# EAGLE design Gamma-TOP (EAGLE 9.6.2)
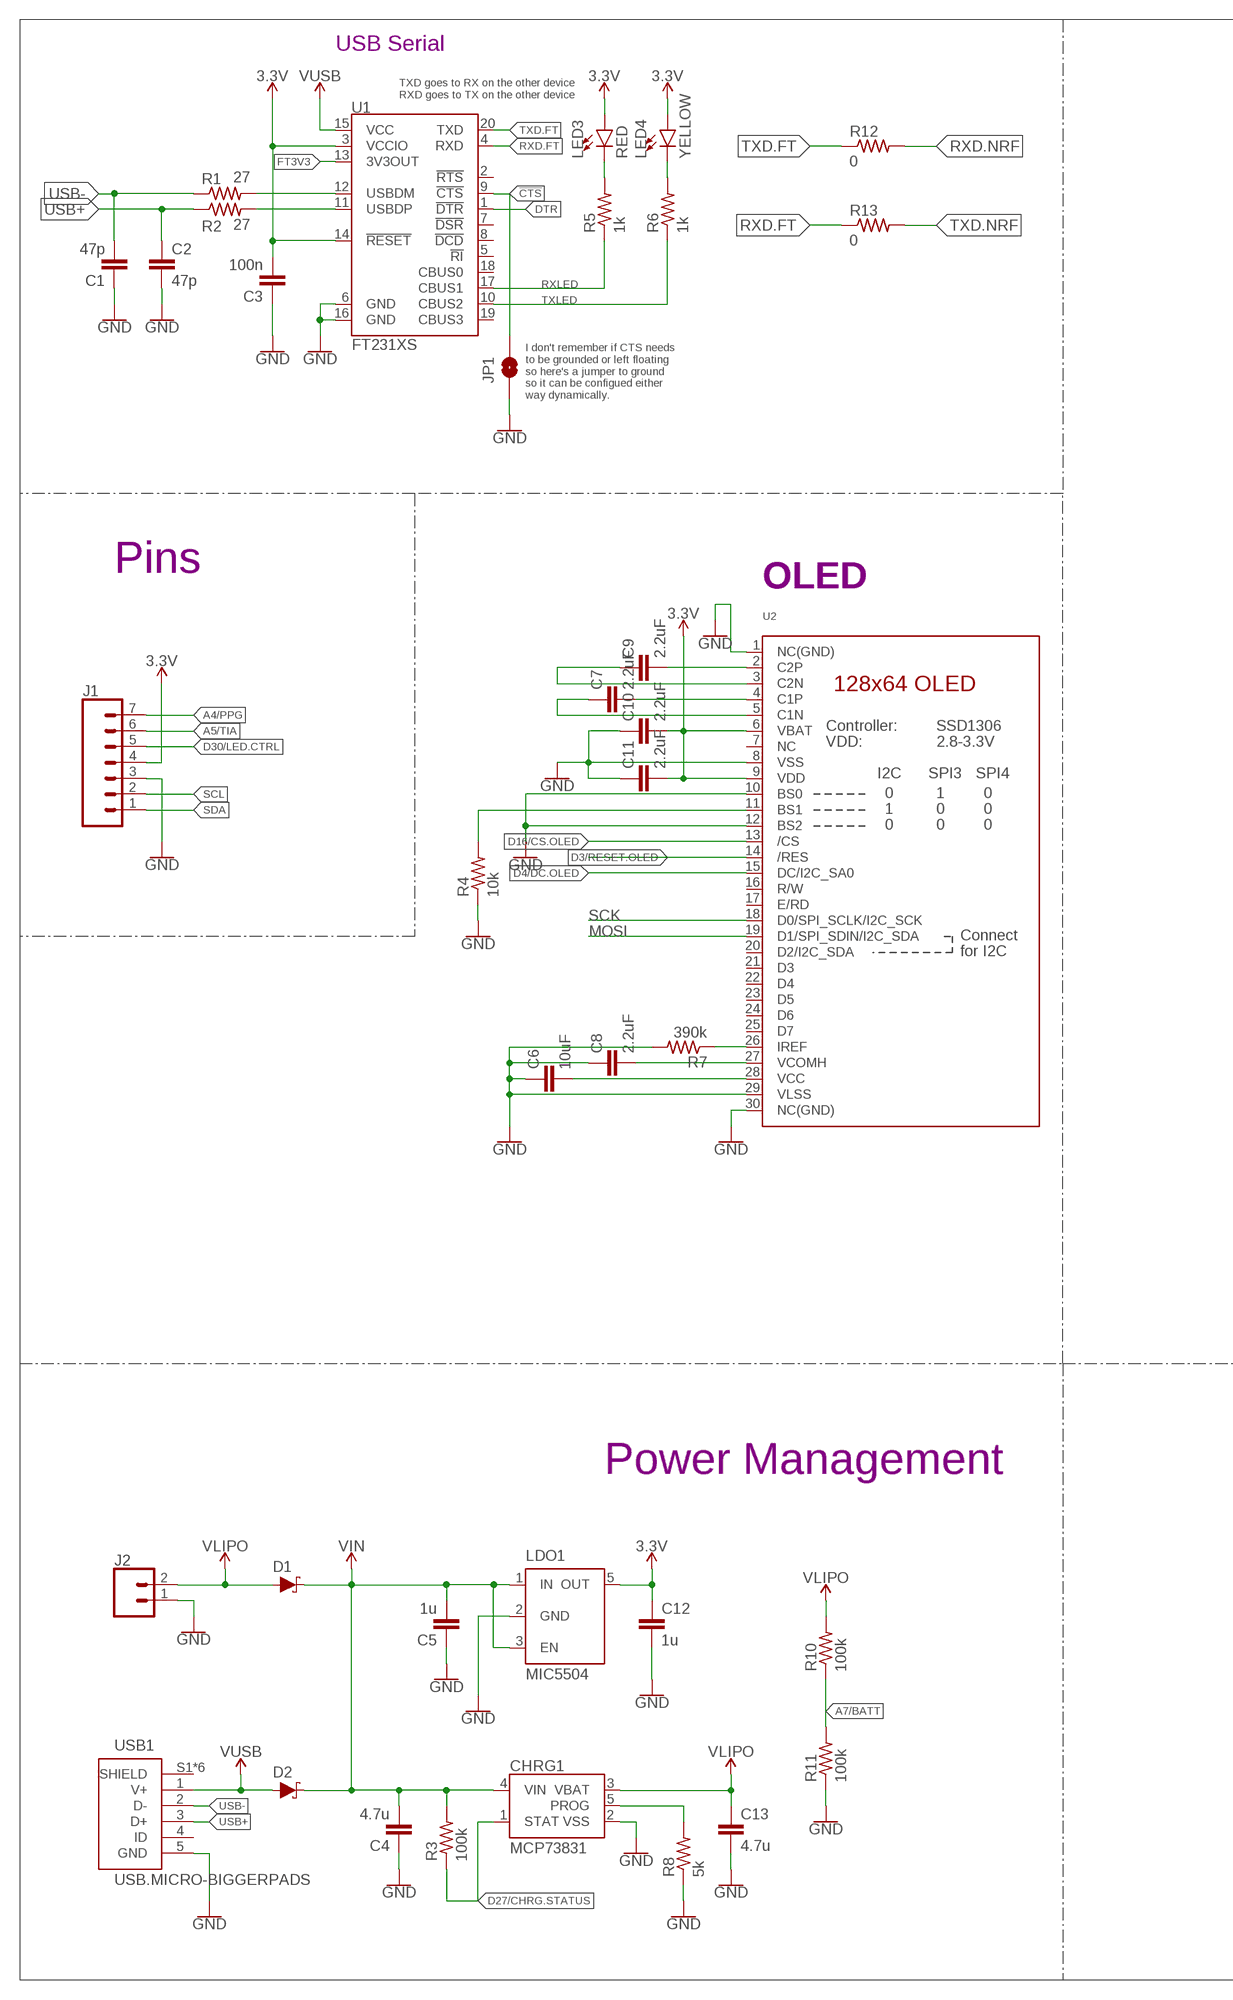
[diagram p0: schematic, sheet 1, part 1 of 2]
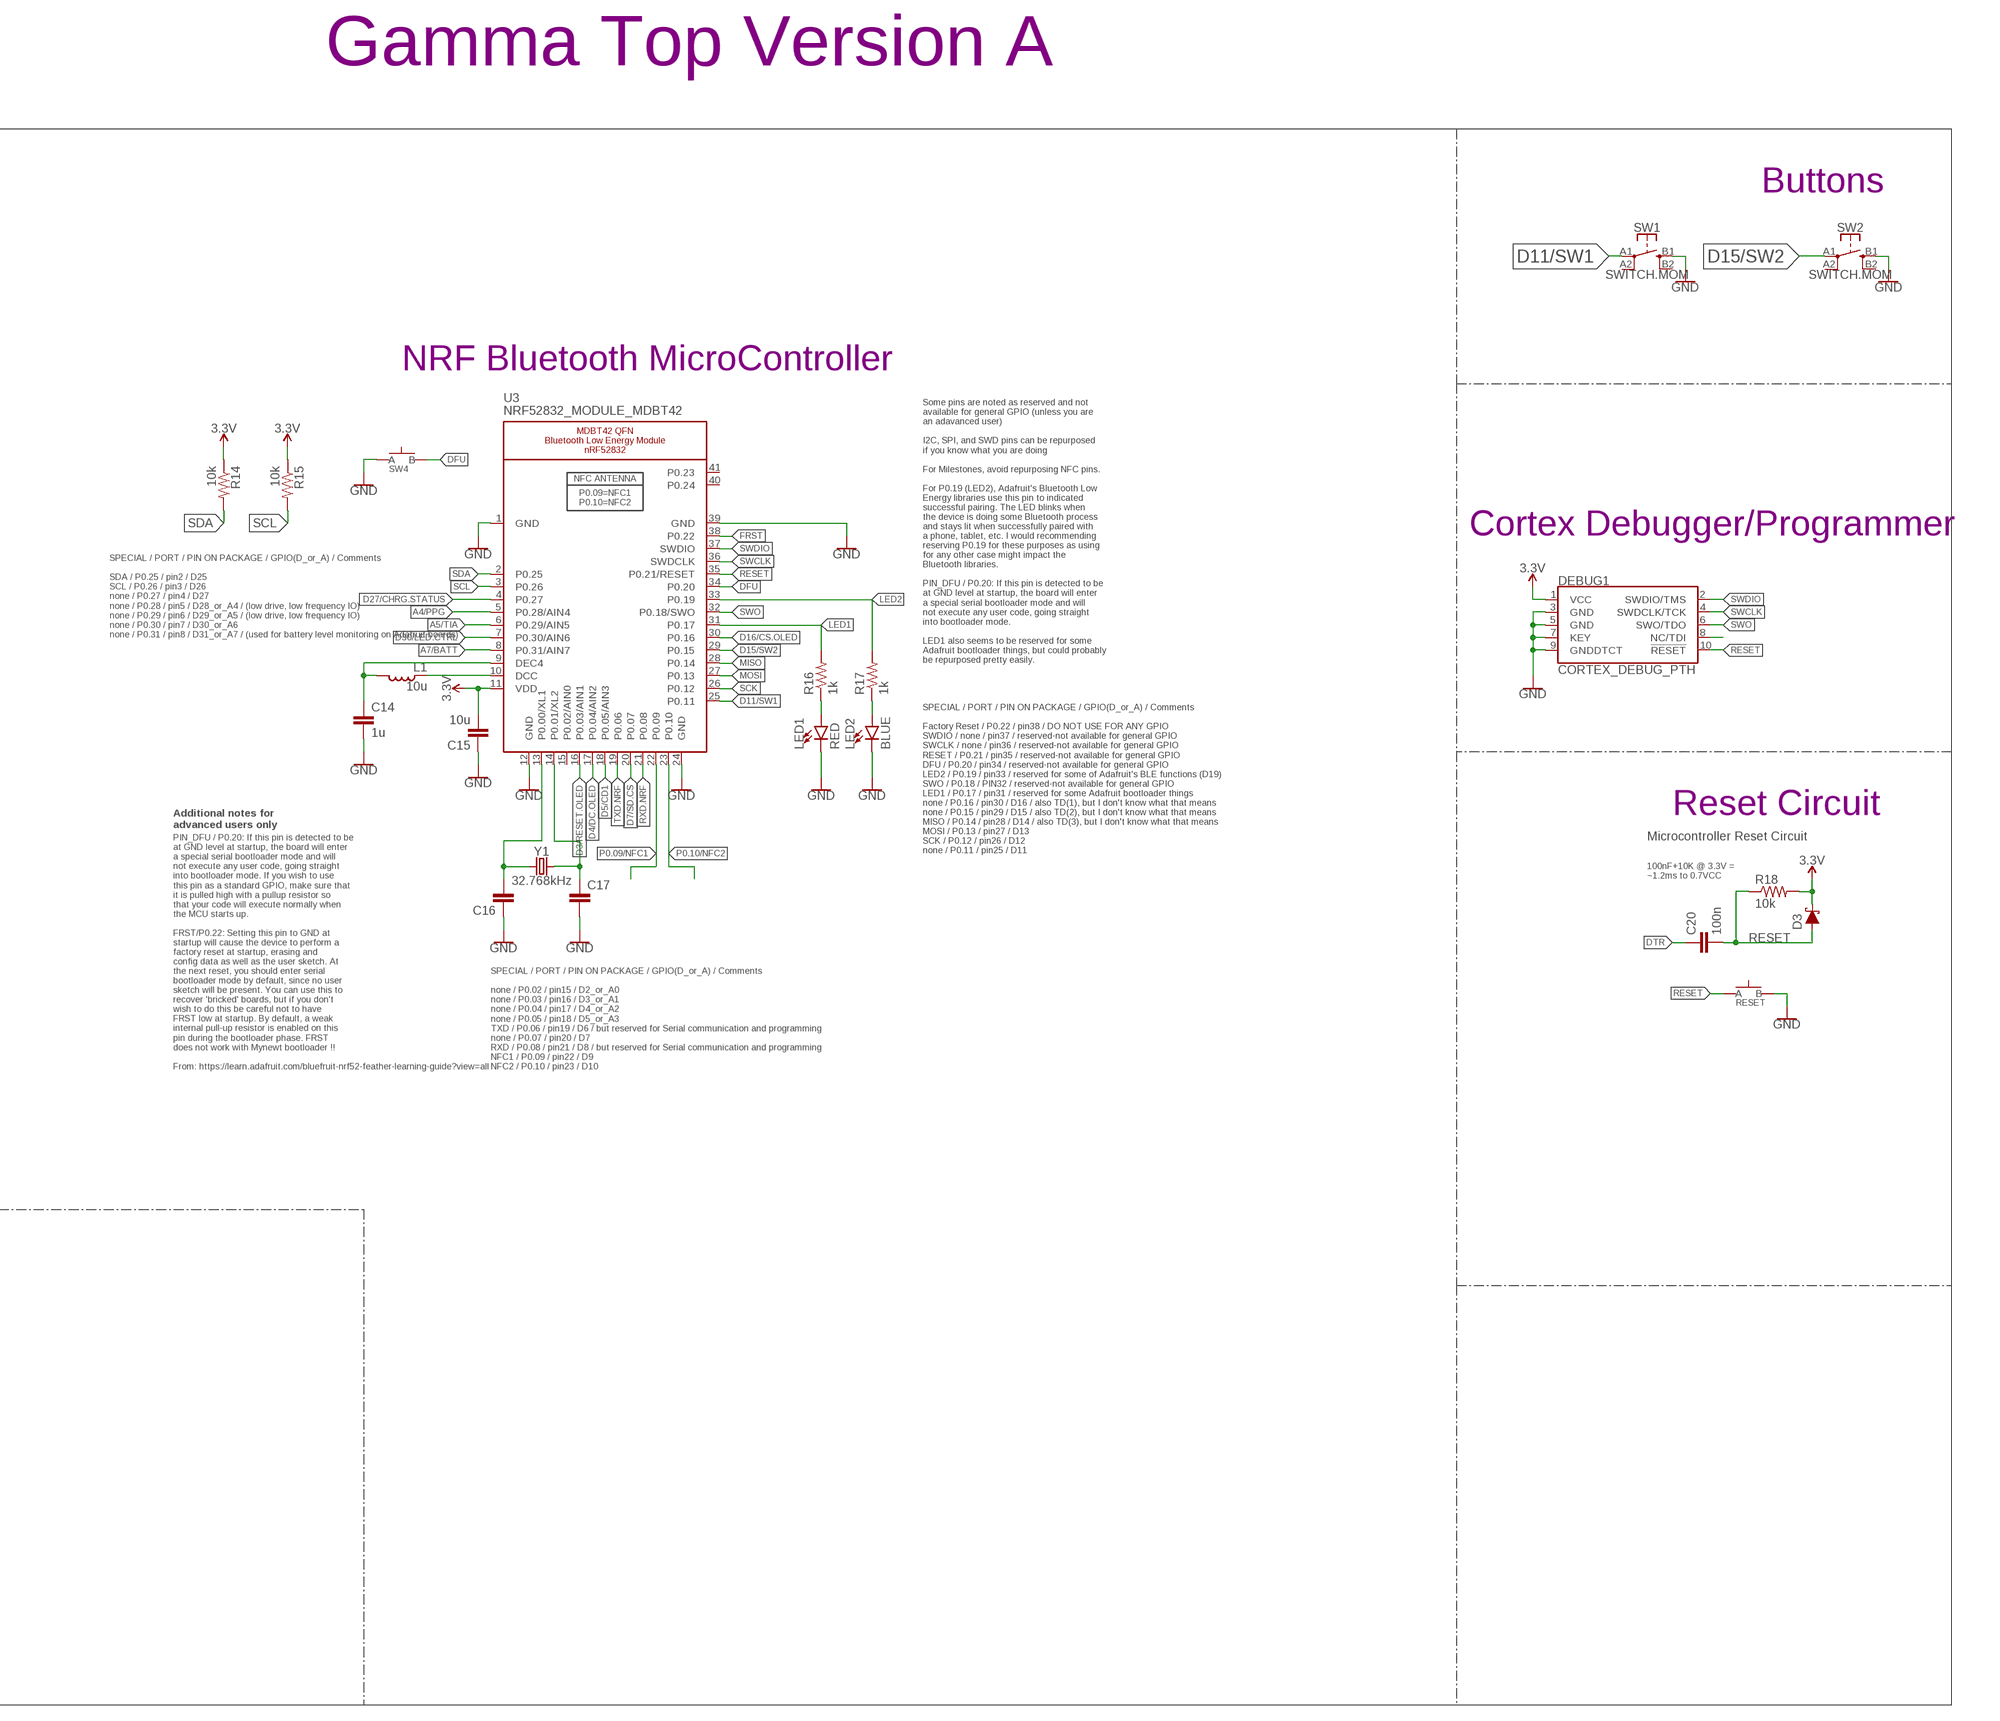
[diagram p1: schematic, sheet 1, part 2 of 2]

## Parts
C1  47p  CAPACITOR0603  [C0603]
C2  47p  CAPACITOR0603  [C0603]
C3  100n  CAPACITOR0603  [C0603]
C4  4.7u  CAPACITOR0603  [C0603]
C5  1u  CAPACITOR0603  [C0603]
C6  10uF  CAPACITOR0603  [C0603]
C7  2.2uF  CAPACITOR0402  [C0402]
C8  2.2uF  CAPACITOR0603  [C0603]
C9  2.2uF  CAPACITOR0402  [C0402]
C10  2.2uF  CAPACITOR0402  [C0402]
C11  2.2uF  CAPACITOR0402  [C0402]
C12  1u  CAPACITOR0603  [C0603]
C13  4.7u  CAPACITOR0603  [C0603]
C14  1u  CAPACITOR0603  [C0603]
C15  10u  CAPACITOR0805  [C0805]
C16  CAPACITOR0603  [C0603]
C17  CAPACITOR0603  [C0603]
C20  100n  CAPACITOR0603  [C0603]
CHRG1  MCP73831  [SOT23-5]
D1  SCHOTTKY-USC  [USC]
D2  SCHOTTKY-USC  [USC]
D3  SCHOTTKY-USC  [USC]
DEBUG1  CORTEX_DEBUG_PTH  [2X5-PTH-1.27MM]
J1  CONN_07-1.27MM  [1X07_1.27MM]
J2  CONN_02  [1X02]
JP1  JUMPER-SMT_2_NO_SILK  [SMT-JUMPER_2_NO_SILK]
L1  10u  INDUCTOR0603  [L0603]
LDO1  MIC5504  [SOT23-5]
LED1  RED  LED0603  [LED-0603]
LED2  BLUE  LED0603  [LED-0603]
LED3  RED  LED0603  [LED-0603]
LED4  YELLOW  LED0603  [LED-0603]
R1  27  RESISTOR0603  [R0603]
R2  27  RESISTOR0603  [R0603]
R3  100k  RESISTOR0603  [R0603]
R4  10k  RESISTOR0603  [R0603]
R5  1k  RESISTOR0603  [R0603]
R6  1k  RESISTOR0603  [R0603]
R7  390k  RESISTOR0603  [R0603]
R8  5k  RESISTOR0603  [R0603]
R10  100k  RESISTOR0603  [R0603]
R11  100k  RESISTOR0603  [R0603]
R12  0  RESISTOR0603  [R0603]
R13  0  RESISTOR0603  [R0603]
R14  10k  RESISTOR0603  [R0603]
R15  10k  RESISTOR0603  [R0603]
R16  1k  RESISTOR0603  [R0603]
R17  1k  RESISTOR0603  [R0603]
R18  10k  RESISTOR0603  [R0603]
RESET  SPST-PTS830GG140-COPY.1-3  [BUTTON-GULLWING]
SW1  SWITCH.MOM  [TACTILE_SWITCH_SMD_6.2MM_TALL]
SW2  SWITCH.MOM  [TACTILE_SWITCH_SMD_6.2MM_TALL]
SW4  SPST-PTS830GG140-COPY.1-3  [BUTTON-GULLWING]
U1  FT231XS  [SSOP20_L]
U2  DISP_OLED_UG-2864HSWEG01-NO-WRAPAROUND  [UG-2864HSWEG01_0.96IN_NO-WRAPAROUND]
U3  NRF52832_MODULE_MDBT42  [BLE_MODULE_RAYTAC_MDBT42]
USB1  USB.MICRO-BIGGERPADS  [USB-MICRO-01.BIGGERPADS]
Y1  32.768kHz  CRYSTALECS-.327-12.5-12-C-TR  [2-SMD.NOLEAD.2.0MMTO1.2MM]

## Nets
3.3V: C3.2 C10.2 C11.2 C12.1 C15.2 D3.-(C) DEBUG1.1(VCC) J1.4 LDO1.5(OUT) LED3.A LED4.A R14.1 R15.1 R18.2 U1.3(VCCIO) U1.14(!RESET) U2.6(VBAT) U2.9(VDD) U3.11(VDD)
!CTS: JP1.2 U1.9(!CTS)
A4/PPG: J1.7 U3.5(P0.28/AIN4)
A5/TIA: J1.6 U3.6(P0.29/AIN5)
A7/BATT: R10.1 R11.2 U3.8(P0.31/AIN7)
D3/RESET.OLED: U2.14(/RES) U3.16(P0.03/AIN1)
D4/DC.OLED: U2.15(DC/I2C_SA0) U3.17(P0.04/AIN2)
D5/CD1: U3.18(P0.05/AIN3)
D7/SD.CS: U3.20(P0.07)
D11/SW1: SW1.A1 U3.25(P0.11)
D15/SW2: SW2.A1 U3.29(P0.15)
D16/CS.OLED: U2.13(/CS) U3.30(P0.16)
D27/CHRG.STATUS: CHRG1.1(STAT) R3.1 U3.4(P0.27)
D30/LED.CTRL: J1.5 U3.7(P0.30/AIN6)
DFU: SW4.3(B) U3.34(P0.20)
DTR: C20.1 U1.1(!DTR)
FRST: U3.38(P0.22)
FT3V3: U1.13(3V3OUT)
GND: C1.1 C2.2 C3.1 C4.1 C5.1 C6.1 C8.1 C10.1 C11.1 C12.2 C13.2 C14.2 C15.1 C16.1 C17.2 CHRG1.2(VSS) DEBUG1.3(GND) DEBUG1.5(GND) DEBUG1.7(KEY) DEBUG1.9(GNDDTCT) J1.3 J2.1 JP1.1 LDO1.2(GND) LED1.C LED2.C R4.1 R7.2 R8.1 R11.1 RESET.3(B) SW1.B1 SW2.B1 SW4.1(A) U1.6(GND) U1.16(GND) U2.1(NC(GND)) U2.8(VSS) U2.10(BS0) U2.12(BS2) U2.29(VLSS) U2.30(NC(GND)) U3.1(GND) U3.12(GND) U3.24(GND) U3.39(GND) USB1.5(GND)
LED1: R16.2 U3.31(P0.17)
LED2: R17.2 U3.33(P0.19)
MISO: U3.28(P0.14)
MOSI: U2.19(D1/SPI_SDIN/I2C_SDA) U3.27(P0.13)
N$1: R4.2 U2.11(BS1)
N$2: R7.1 U2.26(IREF)
N$3: C9.2 U2.2(C2P)
N$4: C16.2 U3.13(P0.00/XL1) Y1.P$1
N$5: C9.1 U2.3(C2N)
N$6: C17.1 U3.14(P0.01/XL2) Y1.P$2
N$7: C7.2 U2.4(C1P)
N$8: C7.1 U2.5(C1N)
N$9: LED1.A R16.1
N$10: LED2.A R17.1
N$11: L1.1 U3.10(DCC)
N$12: C14.1 L1.2 U3.9(DEC4)
N$13: C6.2 U2.28(VCC)
N$14: DEBUG1.8(NC/TDI)
N$15: C8.2 U2.27(VCOMH)
N$17: CHRG1.5(PROG) R8.2
N$23: R1.2 U1.12(USBDM)
N$24: R2.2 U1.11(USBDP)
N$25: LED3.C R5.2
N$26: LED4.C R6.2
P0.09/NFC1: U3.22(P0.09)
P0.10/NFC2: U3.23(P0.10)
RESET: C20.2 D3.+(A) DEBUG1.10(!RESET) R18.1 RESET.1(A) U3.35(P0.21/RESET)
RXD.FT: R13.1 U1.4(RXD)
RXD.NRF: R12.2 U3.21(P0.08)
RXLED: R5.1 U1.17(CBUS1)
SCK: U2.18(D0/SPI_SCLK/I2C_SCK) U3.26(P0.12)
SCL: J1.2 R15.2 U3.3(P0.26)
SDA: J1.1 R14.2 U3.2(P0.25)
SWCLK: DEBUG1.4(SWDCLK/TCK) U3.36(SWDCLK)
SWDIO: DEBUG1.2(SWDIO/TMS) U3.37(SWDIO)
SWO: DEBUG1.6(SWO/TDO) U3.32(P0.18/SWO)
TXD.FT: R12.1 U1.20(TXD)
TXD.NRF: R13.2 U3.19(P0.06)
TXLED: R6.1 U1.10(CBUS2)
USB+: C2.1 R2.1 USB1.3(D+)
USB-: C1.2 R1.1 USB1.2(D-)
V_USB: D2.+(A) U1.15(VCC) USB1.1(V+) ; supply symbol labelled VUSB
VIN: C4.2 C5.2 CHRG1.4(VIN) D1.-(C) D2.-(C) LDO1.1(IN) LDO1.3(EN) R3.2
VLIPO: C13.1 CHRG1.3(VBAT) D1.+(A) J2.2 R10.2
Unconnected: SW1.A2 SW1.B2 SW2.A2 SW2.B2 U1.2(!RTS) U1.5(!RI) U1.7(!DSR) U1.8(!DCD) U1.18(CBUS0) U1.19(CBUS3) U2.7(NC) U2.16(R/W) U2.17(E/RD) U2.20(D2/I2C_SDA) U2.21(D3) U2.22(D4) U2.23(D5) U2.24(D6) U2.25(D7) U3.15(P0.02/AIN0) U3.40(P0.24) U3.41(P0.23) USB1.4(ID) USB1.S1(SHIELD) USB1.S2(SHIELD) USB1.S3(SHIELD) USB1.S4(SHIELD) USB1.S5(SHIELD) USB1.S6(SHIELD)

## Notes on the sheet
- Gamma Top Version A
- USB Serial
- TXD goes to RX on the other device
  RXD goes to TX on the other device
- Buttons
- NRF Bluetooth MicroController
- I don't remember if CTS needs
  to be grounded or left floating
  so here's a jumper to ground
  so it can be configued either
  way dynamically.
- Cortex Debugger/Programmer
- Pins
- OLED
- SPECIAL / PORT / PIN ON PACKAGE / GPIO(D_or_A) / Comments
  
  SDA / P0.25 / pin2 / D25
  SCL / P0.26 / pin3 / D26
  none / P0.27 / pin4 / D27
  none / P0.28 / pin5 / D28_or_A4 / (low drive, low frequency IO)
  none / P0.29 / pin6 / D29_or_A5 / (low drive, low frequency IO)
  none / P0.30 / pin7 / D30_or_A6
  none / P0.31 / pin8 / D31_or_A7 / (used for battery level monitoring on Adafruit boards)
- Some pins are noted as reserved and not
  available for general GPIO (unless you are
  an adavanced user)
  
  I2C, SPI, and SWD pins can be repurposed
  if you know what you are doing
  
  For Milestones, avoid repurposing NFC pins.
  
  For P0.19 (LED2), Adafruit's Bluetooth Low
  Energy libraries use this pin to indicated
  successful pairing. The LED blinks when
  the device is doing some Bluetooth process
  and stays lit when successfully paired with
  a phone, tablet, etc. I would recommending
  reserving P0.19 for these purposes as using
  for any other case might impact the
  Bluetooth libraries.
  
  PIN_DFU / P0.20: If this pin is detected to be
  at GND level at startup, the board will enter
  a special serial bootloader mode and will
  not execute any user code, going straight
  into bootloader mode.
  
  LED1 also seems to be reserved for some
  Adafruit bootloader things, but could probably
  be repurposed pretty easily.
- Reset Circuit
- Additional notes for
  advanced users only
- Microcontroller Reset Circuit
- SPECIAL / PORT / PIN ON PACKAGE / GPIO(D_or_A) / Comments
  
  Factory Reset / P0.22 / pin38 / DO NOT USE FOR ANY GPIO
  SWDIO / none / pin37 / reserved-not available for general GPIO
  SWCLK / none / pin36 / reserved-not available for general GPIO
  RESET / P0.21 / pin35 / reserved-not available for general GPIO
  DFU / P0.20 / pin34 / reserved-not available for general GPIO
  LED2 / P0.19 / pin33 / reserved for some of Adafruit's BLE functions (D19)
  SWO / P0.18 / PIN32 / reserved-not available for general GPIO
  LED1 / P0.17 / pin31 / reserved for some Adafruit bootloader things
  none / P0.16 / pin30 / D16 / also TD(1), but I don't know what that means
  none / P0.15 / pin29 / D15 / also TD(2), but I don't know what that means
  MISO / P0.14 / pin28 / D14 / also TD(3), but I don't know what that means
  MOSI / P0.13 / pin27 / D13
  SCK / P0.12 / pin26 / D12
  none / P0.11 / pin25 / D11
- 100nF+10K @ 3.3V =
  ~1.2ms to 0.7VCC
- PIN_DFU / P0.20: If this pin is detected to be
  at GND level at startup, the board will enter
  a special serial bootloader mode and will
  not execute any user code, going straight
  into bootloader mode. If you wish to use
  this pin as a standard GPIO, make sure that
  it is pulled high with a pullup resistor so
  that your code will execute normally when
  the MCU starts up.
  
  FRST/P0.22: Setting this pin to GND at
  startup will cause the device to perform a
  factory reset at startup, erasing and
  config data as well as the user sketch. At
  the next reset, you should enter serial
  bootloader mode by default, since no user
  sketch will be present. You can use this to
  recover 'bricked' boards, but if you don't
  wish to do this be careful not to have
  FRST low at startup. By default, a weak
  internal pull-up resistor is enabled on this
  pin during the bootloader phase. FRST
  does not work with Mynewt bootloader !!
  
  From: https://learn.adafruit.com/bluefruit-nrf52-feather-learning-guide?view=all
- SPECIAL / PORT / PIN ON PACKAGE / GPIO(D_or_A) / Comments
  
  none / P0.02 / pin15 / D2_or_A0
  none / P0.03 / pin16 / D3_or_A1
  none / P0.04 / pin17 / D4_or_A2
  none / P0.05 / pin18 / D5_or_A3
  TXD / P0.06 / pin19 / D6 / but reserved for Serial communication and programming
  none / P0.07 / pin20 / D7
  RXD / P0.08 / pin21 / D8 / but reserved for Serial communication and programming
  NFC1 / P0.09 / pin22 / D9
  NFC2 / P0.10 / pin23 / D10
- Power Management

## Library data of the parts
C1-C17 C20 = LinnesLab-Passives:CAPACITOR
CHRG1 = LinnesLab-Power:MCP73831: MCP73831T Li-Ion, Li-Pol Controller Miniature single cell, fully integrated Li-Ion, Li-polymer charge management controller Datasheet <http://ww1.microchip.com/downloads/en/DeviceDoc/20001984g.pdf> SparkFun Products: SparkFun ESP32 Thing <https://www.sparkfun.com/products/13907> SparkFun 9DoF Razor IMU M0 <https://www.sparkfun.com/products/14001>; PROD_ID: IC-09995
D1-D3 = LinnesLab-DiscreteSemi:SCHOTTKY: Schottky diode A Schottky diode is a semiconductor diode which has a low forward voltage drop and a very fast switching action. Example: Digi-Key Part Number: RB161MM-20CT-ND
DEBUG1 = LinnesLab-Connectors:CORTEX_DEBUG: Cortex Debug Connector - 10 pin Supports JTAG debug, Serial Wire debug, and Serial Wire Viewer. PTH and SMD connector options available. General Connector Information <http://infocenter.arm.com/help/topic/com.arm.doc.faqs/attached/13634/cortex_debug_connectors.pdf> Products: PTH Connector <http://www.digikey.com/product-detail/en/cnc-tech/3220-10-0100-00/1175-1627-ND/3883661> -via Digi-Key SparkFun PSoc <https://www.sparkfun.com/products/13229> SparkFun T <https://www.sparkfun.com/products/13810>
J1 = LinnesLab-Connectors:CONN_07: Multi connection point. Often used as Generic Header-pin footprint for 0.1 inch spaced/style header connections On any of the 0.1 inch spaced packages, you can populate with these: Break Away Headers - Straight <https://www.sparkfun.com/products/116> (PRT-00116) Break Away Male Headers - Right Angle <https://www.sparkfun.com/products/553> (PRT-00553) Female Headers <https://www.sparkfun.com/products/115> (PRT-00115) Break Away Headers - Machine Pin <https://www.sparkfun.com/products/117> (PRT-00117) Break Away Female Headers - Swiss Machine Pin <https://www.sparkfun.com/products/743> (PRT-00743) For SCREWTERMINALS and SPRING TERMINALS visit here: Screw Terimnals on SparkFun.com <https://www.sparkfun.com/search/results?term=Screw+Terminals> (5mm/3.5mm/2.54mm spacing) This device is also useful as a general connection point to wire up your design to another part of your project. Our various solder wires solder well into these plated through hole pads. Hook-Up Wire - Assortment (Stranded, 22 AWG) <https://www.sparkfun.com/products/11375> (PRT-11375) Hook-Up Wire - Assortment (Solid Core, 22 AWG) <https://www.sparkfun.com/products/11367> (PRT-11367) View the entire wire category on our website here <https://www.sparkfun.com/categories/141> Special notes: Molex polarized connector foot print use with SKU : PRT-08231 with associated crimp pins and housings. 1MM SMD Version SKU: PRT-10208 NOTES ON THE VARIANTS LOCK and LOCK_LONGPADS... This footprint was designed to help hold the alignment of a through-hole component (i.e. 6-pin header) while soldering it into place. You may notice that each hole has been shifted either up or down by 0.005 of an inch from it's more standard position (which is a perfectly straight line). This slight alteration caused the pins (the squares in the middle) to touch the edges of the holes. Because they are alternating, it causes a "brace" to hold the component in place. 0.005 has proven to be the perfect amount of "off-center" position when using our standard breakaway headers. Although looks a little odd when you look at the bare footprint, once you have a header in there, the alteration is very hard to notice. Also,if you push a header all the way into place, it is covered up entirely on the bottom side.
J2 = LinnesLab-Connectors:CONN_02: Multi connection point. Often used as Generic Header-pin footprint for 0.1 inch spaced/style header connections On any of the 0.1 inch spaced packages, you can populate with these: Break Away Headers - Straight <https://www.sparkfun.com/products/116> (PRT-00116) Break Away Male Headers - Right Angle <https://www.sparkfun.com/products/553> (PRT-00553) Female Headers <https://www.sparkfun.com/products/115> (PRT-00115) Break Away Headers - Machine Pin <https://www.sparkfun.com/products/117> (PRT-00117) Break Away Female Headers - Swiss Machine Pin <https://www.sparkfun.com/products/743> (PRT-00743) For SCREWTERMINALS and SPRING TERMINALS visit here: Screw Terimnals on SparkFun.com <https://www.sparkfun.com/search/results?term=Screw+Terminals> (5mm/3.5mm/2.54mm spacing) This device is also useful as a general connection point to wire up your design to another part of your project. Our various solder wires solder well into these plated through hole pads. Hook-Up Wire - Assortment (Stranded, 22 AWG) <https://www.sparkfun.com/products/11375> (PRT-11375) Hook-Up Wire - Assortment (Solid Core, 22 AWG) <https://www.sparkfun.com/products/11367> (PRT-11367) View the entire wire category on our website here <https://www.sparkfun.com/categories/141> Special notes: Molex polarized connector foot print use with: PRT-08233 with associated crimp pins and housings. 2.54_SCREWTERM for use with PRT-10571. 3.5mm Screw Terminal footprints for PRT-08084 5mm Screw Terminal footprints for use with PRT-08432
JP1 = LinnesLab-Switches:JUMPER-SMT_2_NO: Normally open jumper This jumper has two pads in close proximity to each other. Apply solder to close the connection. Round pads are easier to solder for beginners, but are a lot larger. SparkFun Product that uses the round pads: SparkFun EL Sequencer <https://www.sparkfun.com/products/12781>
L1 = LinnesLab-Passives:INDUCTOR
LDO1 = LinnesLab-Power:MIC5504: MIC5504 Voltage Regulator Output Voltages: 1.0V to 3.3V Input Voltages: 2.5V to 5.5V Link to Datasheet http://ww1.microchip.com/downloads/en/DeviceDoc/MIC550X.pdf
LED1-LED4 = LinnesLab-LED:LED: LED (Generic) Standard schematic elements and footprints for 5mm, 3mm, 1206, and 0603 sized LEDs. Generic LEDs with no color specified. LTST-C190KGKT: arrow indicates cathode
R1-R8 R10-R18 = LinnesLab-Passives:RESISTOR
RESET SW4 = LinnesLab-Switches:SPST-PTS830GG140-COPY
SW1 SW2 = LinnesLab-Switches:SWITCH.MOM: PTS645SM43SMTR92 LFS
U1 = LinnesLab-DigitalIC:FT231X: FTDI FT231X Full Speed USB to Full-handshake UART This USB2.0 Full Speed IC offers a compact bridge to full handshake UART interfaces. The device is a UART, capable of operating up to 3MBaud, with low power consumption (8mA). The FT231X includes the complete FT-X series feature set and enables USB to be added into a system design quickly and easily over a UART interface. Datasheet <http://cdn.sparkfun.com/datasheets/Components/General%20IC/DS_FT231X.pdf>; DIGIKEY: 768-1156-5-ND; MFN: FT231XS-U
U2 = LinnesLab-Displays:DISP_OLED_UG-2864HSWEG01: UG-2864HSWEG01 OLED display Both 1.3" and 0.96" models share the same FPC tab footprint, only the screen dimensions vary.
U3 = LinnesLab-Microcontrollers:NRF52832_MODULE_MDBT42: MDBT42 - BLE Module (nRF52832 QFN) VDD: 1.7-3.6V
USB1 = LinnesLab-Connectors:USB.MICRO: DigiKey PN: 609-4613-1-ND
Y1 = LinnesLab-Clocks:CRYSTAL; DIGIKEY: XC2288CT-ND; FREQ: 32.7680KHZ; LOAD_CAP: 12.5pF

## Board
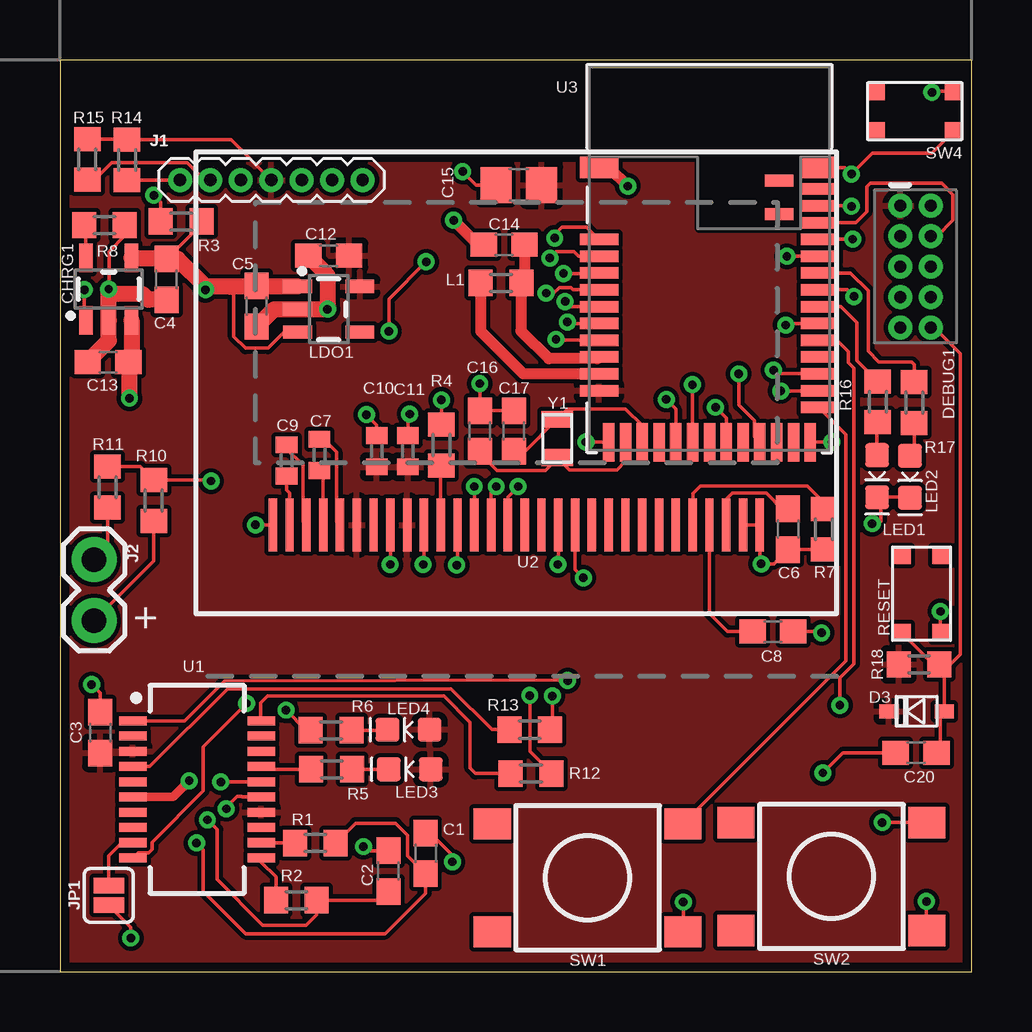
[diagram p2: board, top side]
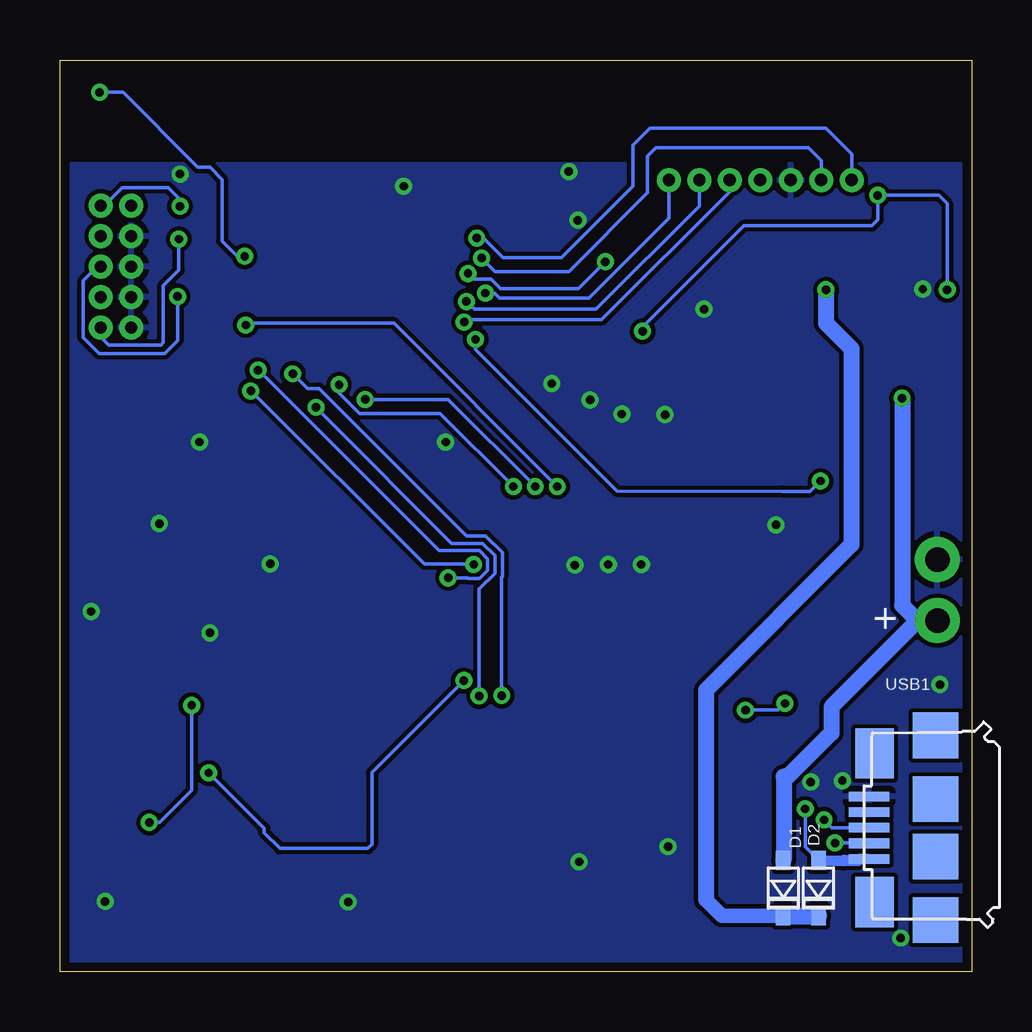
[diagram p3: board, bottom side, seen from below]

Size 38 x 38 mm. Coordinates in mm from the lower left corner, seen from the top.
Outline: 0,0 38,0 38,38 0,38 0,0
Copper layers (1*16): Top 0.0356mm / dielectric 1.5011mm / Bottom 0.0356mm
Design rules "LaenPCBOrder": minimum track width 6mil, minimum drill 13mil, track to track 6mil, track to pad 6mil, pad to pad 6mil, via to via 6mil, smd to smd 6mil, copper to edge 15mil, drill to drill 6mil, minimum pad ring 7mil, minimum via ring 7mil, stop-mask expansion 3mil, vias tented up to drill 0mil, thermal gap 10mil

### Footprints (pad centres in the part's own frame; a part is rotated, then mirrored left to right if it is on the bottom)
C0603 = smd 1.1 x 1: 1 -0.85,0; 2 0.85,0
C0402 = smd 0.7 x 0.9: 1 -0.65,0; 2 0.65,0
C0805 = smd 1.3 x 1.5: 1 -0.95,0; 2 0.95,0
SOT23-5 = smd 0.55 x 1.2: 1 -0.95,-1.3; 2 0,-1.3; 3 0.95,-1.3; 4 0.95,1.3; 5 -0.95,1.3
USC = smd 0.8 x 0.6: + -1.15,0; - 1.15,0
2X5-PTH-1.27MM = drill 0.508 pad 1: 1 -2.54,-0.635; 2 -2.54,0.635; 3 -1.27,-0.635; 4 -1.27,0.635; 5 0,-0.635; 6 0,0.635; 7 1.27,-0.635; 8 1.27,0.635; 9 2.54,-0.635; 10 2.54,0.635
1X07_1.27MM = drill 0.508 pad 1: 1 0,0; 2 1.27,0; 3 2.54,0; 4 3.81,0; 5 5.08,0; 6 6.35,0; 7 7.62,0
1X02 = drill 1.016 pad 1.88: 1 0,0; 2 2.54,0
SMT-JUMPER_2_NO_SILK = smd 0.635 x 1.27: 1 -0.406,0; 2 0.406,0
L0603 = smd 1 x 1.1: 1 -0.85,0; 2 0.85,0
LED-0603 = smd 1 x 1: A -0.877,0; C 0.877,0
R0603 = smd 1 x 1.1: 1 -0.85,0; 2 0.85,0
BUTTON-GULLWING = smd 0.7 x 0.75: 1 -1.6,0.825; 2 1.6,0.825; 3 -1.6,-0.825; 4 1.6,-0.825
TACTILE_SWITCH_SMD_6.2MM_TALL = smd 1.55 x 1.3: A1 -3.975,-2.25; A2 3.975,-2.25; B1 -3.975,2.25; B2 3.975,2.25
SSOP20_L = smd 0.381 x 1.143: 1 -2.857,-2.68; 2 -2.223,-2.68; 3 -1.587,-2.68; 4 -0.953,-2.68; 5 -0.318,-2.68; 6 0.318,-2.68; 7 0.953,-2.68; 8 1.587,-2.68; 9 2.223,-2.68; 10 2.857,-2.68; 11 2.857,2.68; 12 2.223,2.68; 13 1.587,2.68; 14 0.953,2.68; 15 0.318,2.68; 16 -0.318,2.68; 17 -0.953,2.68; 18 -1.587,2.68; 19 -2.223,2.68; 20 -2.857,2.68
UG-2864HSWEG01_0.96IN_NO-WRAPAROUND = smd 0.35 x 2.2: 1 -10.15,-1.2; 2 -9.45,-1.2; 3 -8.75,-1.2; 4 -8.05,-1.2; 5 -7.35,-1.2; 6 -6.65,-1.2; 7 -5.95,-1.2; 8 -5.25,-1.2; 9 -4.55,-1.2; 10 -3.85,-1.2; 11 -3.15,-1.2; 12 -2.45,-1.2; 13 -1.75,-1.2; 14 -1.05,-1.2; 15 -0.35,-1.2; 16 0.35,-1.2; 17 1.05,-1.2; 18 1.75,-1.2; 19 2.45,-1.2; 20 3.15,-1.2; 21 3.85,-1.2; 22 4.55,-1.2; 23 5.25,-1.2; 24 5.95,-1.2; 25 6.65,-1.2; 26 7.35,-1.2; 27 8.05,-1.2; 28 8.75,-1.2; 29 9.45,-1.2; 30 10.15,-1.2
BLE_MODULE_RAYTAC_MDBT42 = smd 1.6 x 0.9: 1 -4.6,3.8; 39 4.6,3.8 | smd 1.6 x 0.48: 2 -4.6,0.8; 3 -4.6,0.1; 4 -4.6,-0.6; 5 -4.6,-1.3; 6 -4.6,-2; 7 -4.6,-2.7; 8 -4.6,-3.4; 9 -4.6,-4.1; 10 -4.6,-4.8; 11 -4.6,-5.5; 25 4.6,-6.2; 26 4.6,-5.5; 27 4.6,-4.8; 28 4.6,-4.1; 29 4.6,-3.4; 30 4.6,-2.7; 31 4.6,-2; 32 4.6,-1.3; 33 4.6,-0.6; 34 4.6,0.1; 35 4.6,0.8; 36 4.6,1.5; 37 4.6,2.2; 38 4.6,2.9 | smd 0.48 x 1.6: 12 -4.2,-7.65; 13 -3.5,-7.65; 14 -2.8,-7.65; 15 -2.1,-7.65; 16 -1.4,-7.65; 17 -0.7,-7.65; 18 0,-7.65; 19 0.7,-7.65; 20 1.4,-7.65; 21 2.1,-7.65; 22 2.8,-7.65; 23 3.5,-7.65; 24 4.2,-7.65 | smd 1.2 x 0.5: 40 2.9,3.25; 41 2.9,1.85
USB-MICRO-01.BIGGERPADS = smd 0.4 x 1.7: 1 -1.3,1.505; 2 -0.65,1.505; 3 0,1.505; 4 0.65,1.505; 5 1.3,1.505 | smd 1.9 x 1.9: S1 -3.85,-1.27; S2 -1.2,-1.27; S3 1.2,-1.27; S4 3.85,-1.27 | smd 2.1 x 1.6: S5 -3.1,1.28; S6 3.1,1.28
2-SMD.NOLEAD.2.0MMTO1.2MM = smd 0.7 x 1.3: P$1 -0.8,0; P$2 0.8,0

### Placement (x,y rotation side)
C1  15.24,4.93 270 top
C2  13.69,4.19 90 top
C3  1.68,9.96 270 top
C4  4.45,28.85 90 top
C5  8.2,27.74 90 top
C6  30.35,18.44 90 top
C7  10.82,21.54 270 top
C8  29.72,14.17 180 top
C9  9.45,21.31 270 top
C10  13.21,21.69 270 top
C11  14.5,21.69 270 top
C12  11.2,29.84 180 top
C13  2.01,25.4 180 top
C14  18.52,30.3 180 top
C15  19.13,32.79 0 top
C16  17.5,22.53 270 top
C17  18.92,22.53 90 top
C20  35.69,9.12 0 top
CHRG1  2.03,28.45 0 top
D1  7.85,3.48 270 bottom
D2  6.38,3.48 270 bottom
D3  35.71,10.85 180 top
DEBUG1  35.66,29.39 270 top
J1  5,33 0 top
J2  1.42,17.17 270 top
JP1  2.03,3.17 90 top
L1  18.39,28.7 0 top
LDO1  11.2,27.61 270 top
LED1  34.06,20.65 270 top
LED2  35.43,20.62 270 top
LED3  14.58,8.43 180 top
LED4  14.53,10.08 180 top
R1  10.64,5.36 180 top
R2  9.86,2.97 180 top
R3  5.05,31.27 0 top
R4  15.9,21.95 270 top
R5  11.33,8.43 0 top
R6  11.3,10.06 0 top
R7  31.85,18.44 270 top
R8  1.85,31.11 180 top
R10  3.91,19.63 270 top
R11  1.98,20.19 90 top
R12  19.63,8.26 0 top
R13  19.58,10.08 0 top
R14  2.79,33.83 270 top
R15  1.14,33.86 270 top
R16  34.09,23.75 90 top
R17  35.61,23.72 90 top
R18  35.81,12.8 180 top
RESET  35.92,15.75 90 top
SW1  22,3.91 180 top
SW2  32.16,3.96 180 top
SW4  35.64,35.86 180 top
U1  5.71,7.59 270 top
U2  19.02,19.81 0 top
U3  27.08,29.72 0 top
USB1  2.77,5.99 90 bottom
Y1  20.73,22.23 90 top

### Tracks (layer width: path | path; a pad name or v marks a point on that pad's centre or on a via)
3.3V
  Top 0.152: R15.1 2.77,34.71 R14.1 7.13,34.68 J1.4
  pour Top (isolate 0.178): 0.18,33.68 37.77,33.68 37.77,0.3 0.18,0.3
!CTS
  Top 0.152: U1.9 3.02,5.38 2.6,5.38 2.03,4.82 JP1.2
A4/PPG  (via drill 0.35)
  Top 0.152: v20.27,28.28 20.58,28.28 20.82,28.52 21.3,28.52 21.39,28.42 U3.5
  Bottom 0.152: J1.7 12.62,31.4 15.94,28.08 19.68,28.08 19.89,28.28 v20.27,28.28
A5/TIA  (via drill 0.35)
  Top 0.152: U3.6 21.27,27.72 v21.06,27.93
  Bottom 0.152: v21.06,27.93 20.73,27.6 15.65,27.6 11.35,31.91 J1.6
A7/BATT  (via drill 0.35)
  Top 0.152: R11.2 3.35,21.04 R10.1 6.26,20.48 v6.3,20.45 | U3.8 20.71,26.32 v20.68,26.36
  Bottom 0.152: v20.68,26.36 20.68,25.92 14.79,20.04 7.9,20.02 6.73,20.02 v6.3,20.45
D3/RESET.OLED  (via drill 0.35)
  Top 0.152: U2.14 17.98,20.01 v18.19,20.22 | v25.27,23.85 25.68,23.45 U3.16
  Bottom 0.152: v18.19,20.22 21.82,23.85 v25.27,23.85
D4/DC.OLED  (via drill 0.35)
  Top 0.152: U2.15 18.68,19.79 v19.1,20.22 | v26.36,24.46 26.36,22.08 U3.17
  Bottom 0.152: v19.1,20.22 22.15,23.27 25.51,23.27 26.36,24.12 v26.36,24.46
D11/SW1
  Top 0.152: U3.25 31.68,23.48 32.76,22.39 32.76,12.95 SW1.A1
D15/SW2  (via drill 0.35)
  Top 0.152: U3.29 32.39,26.32 32.86,25.85 32.86,25.39 33.1,25.15 33.1,12.83 32.51,12.24 v32.51,11.1 | v34.27,6.21 SW2.A1
  Bottom 0.152: v32.51,11.1 32.51,7.54 33.84,6.21 v34.27,6.21
D16/CS.OLED  (via drill 0.35)
  Top 0.152: U2.13 17.27,20.17 17.3,20.22 v17.27,20.22 | v30.25,26.95 30.32,27.02 U3.30
  Bottom 0.152: v17.27,20.22 24.08,27.03 30.18,27.03 v30.25,26.95
D27/CHRG.STATUS  (via drill 0.35)
  Top 0.152: R3.1 4.21,32.07 v3.91,32.36 | v1.02,28.42 1.02,27.21 CHRG1.1 | U3.4 22.46,29.1 v20.99,29.1 | v13.72,26.7 13.72,28.04 v15.27,29.59
  Bottom 0.152: v1.02,28.42 1.02,32 1.37,32.36 v3.91,32.36 3.91,31.34 4.17,31.09 9.5,31.09 13.72,26.87 v13.72,26.7 | v20.99,29.1 20.75,28.86 20.02,28.86 19.64,28.47 16.38,28.47 v15.27,29.59
D30/LED.CTRL  (via drill 0.35)
  Top 0.152: U3.7 21.21,27.02 v21.15,27.08
  Bottom 0.152: v21.15,27.08 21.05,27.18 15.42,27.18 10.08,32.52 J1.5
DFU  (via drill 0.35)
  Top 0.152: U3.34 v30.3,29.82 | v36.35,36.65 36.38,36.69 SW4.3
  Bottom 0.152: v36.35,36.65 35.37,36.65 32.36,33.64 32.36,33.63 32.26,33.53 31.75,33.53 31.24,33.02 31.24,30.45 30.61,29.82 v30.3,29.82
DTR  (via drill 0.35)
  Top 0.152: C20.1 32.64,9.12 v31.8,8.28 | U1.1 5.2,10.45 6.86,12.11 21.14,12.15 v21.16,12.13
  Bottom 0.152: v31.8,8.28 29.49,5.97 29.49,5.79 28.83,5.13 25.17,5.13 24.99,5.31 24.99,8.29 v21.16,12.13
GND  (via drill 0.35)
  Top 0.152: 8.88,18.59 U2.1 v8.16,18.61 v8.15,18.62 | v12.78,23.22 13.21,22.78 C10.1 | v14.58,23.24 14.5,23.16 C11.1 | U2.8 v13.78,16.98 v13.77,16.97 | U2.10 15.18,17 v15.14,16.97 | U2.12 16.57,16.98 v16.54,16.94 | U2.29 U2.30 | U2.30 29.22,18.66 | C2.2 12.81,5.04 12.68,5.21 v12.65,5.21 | v16.36,4.57 16.36,4.85 15.43,5.78 C1.1 | R11.1 1.98,17.73 J2.1 | U2.30 29.18,17.05 v29.23,16.99 29.75,16.99 C6.1 R7.2 | C17.2 C16.1 v17.5,24.51 | U3.12 v21.92,22.07 | 25.91,1.73 SW1.B1 25.98,1.67 v25.98,2.9 | R4.1 v15.9,23.82 | LED2.C 35.41,19.77 LED1.C 34.21,19.62 34.21,18.77 34.11,18.67 v33.86,18.67 | RESET.3 36.7,14.19 v36.7,15.01 | U3.24 v32.18,22.07 | C8.1 31.7,14.17 v31.75,14.12 | v36.12,2.92 36.12,1.73 SW2.B1 | C3.1 1.68,11.61 v1.32,11.96 | JP1.1 2.95,1.85 v2.95,1.4 | U3.39 32.73,33.52 v32.99,33.25 33.86,34.11 36.35,34.11 37.24,35 SW4.1 | R8.1 2.7,30.67 2.04,30.01 2.04,28.46 v2.03,28.45 | C15.1 17.35,32.79 v16.79,33.35 | U1.16 v6.71,7.9
  Top 0.356: U1.6 4.71,7.28 v5.38,7.95
  Top 0.457: C14.2 17.42,30.3 v16.41,31.32 | U3.1 22.89,33.52 v23.67,32.74
  Top 0.66: C13.2 1.16,25.43 2.03,26.31 CHRG1.2 v2.03,28.45 2.25,28.23 3.46,28.23 3.68,28 C4.1 | C5.1 8.93,27.61 LDO1.2 v11.15,27.61 11.15,29.01 11.02,29.14 11.02,29.18 C12.2
  pour Bottom (isolate 0.178): 37.74,33.68 0.18,33.68 0.18,0.28 37.77,0.28 37.77,33.68
LED1
  Top 0.152: U3.31 32.56,27.72 33.22,27.05 33.22,25.46 R16.2
LED2
  Top 0.152: U3.33 32.95,29.11 33.69,28.38 33.69,25.86 34.15,25.4 35.52,25.4 35.61,25.31 R17.2
MOSI  (via drill 0.35)
  Top 0.152: U2.19 21.48,16.75 v21.82,16.41 | v29.74,25.07 29.89,24.92 U3.27
  Bottom 0.152: v21.82,16.41 21.02,16.41 20.99,16.39 20.51,16.39 20.17,16.73 20.17,17.21 20.51,17.55 22.2,17.55 29.72,25.07 v29.74,25.07
N$1
  Top 0.152: R4.2 15.88,21.07 U2.11
N$2
  Top 0.152: U2.26 26.39,18.63 26.39,19.93 26.7,20.25 31.15,20.25 31.85,19.55 R7.1
N$3
  Top 0.152: C9.2 9.45,20.07 9.57,19.94 U2.2
N$4
  Top 0.152: U3.13 23.57,21.27 23.21,20.91 21.24,20.91 Y1.P$1 20.73,21.37 20.24,20.89 18.21,20.89 17.5,21.6 C16.2
N$5
  Top 0.152: C9.1 9.45,21.78 10.13,21.11 10.13,18.76 U2.3
N$6
  Top 0.152: U3.14 24.27,22.76 23.58,23.45 21.15,23.45 Y1.P$2 19.38,21.68 C17.1
N$7
  Top 0.152: C7.2 10.97,20.73 U2.4
N$8
  Top 0.152: C7.1 11,22.19 11.52,21.66 11.52,18.76 U2.5
N$9
  Top 0.152: R16.1 34.06,22.87 LED1.A
N$10
  Top 0.152: R17.1 35.61,21.68 LED2.A
N$11
  Top 0.457: L1.1 17.54,26.69 19.31,24.92 U3.10
N$12
  Top 0.457: U3.9 22.4,25.55 20.38,25.55 19.21,26.71 19.21,28.68 L1.2 19.37,28.83 C14.1
N$13
  Top 0.152: U2.28 27.77,19.68 28.03,19.94 29.44,19.94 30.09,19.29 C6.2
N$15
  Top 0.152: C8.2 27.83,14.17 27.07,14.93 U2.27
N$17
  Top 0.152: R8.2 1.08,31.04 CHRG1.5
N$23
  Top 0.152: U1.12 9.78,5.37 R1.2
N$24
  Top 0.152: R2.2 9.01,3.95 8.39,4.56 U1.11
N$25
  Top 0.152: R5.2 LED3.C
N$26
  Top 0.152: LED4.C 13.63,10.06 R6.2
RESET  (via drill 0.35)
  Top 0.152: C20.2 36.69,9.27 36.69,10.67 D3.+ 36.86,12.6 R18.1 | RESET.1 35.09,14.12 36.41,12.8 R18.1 | R18.1 37.12,12.8 37.54,13.22 37.54,25.76 36.45,26.85 DEBUG1.10 | U3.35 v33.05,30.53
  Bottom 0.152: DEBUG1.10 36.3,26.45 35.96,26.12 33.78,26.12 33.69,26.22 33.69,28.59 33.05,29.23 v33.05,30.53
RXD.FT
  Top 0.152: R13.1 18.01,10.08 16.31,11.79 6.99,11.79 3.75,8.55 U1.4
RXD.NRF  (via drill 0.35)
  Top 0.152: U3.21 28.95,22.3 28.95,22.96 28.3,23.61 v28.3,24.92 | R12.2 19.58,9.17 v19.58,11.51
  Bottom 0.152: v28.3,24.92 27.69,24.31 27.2,24.31 21.05,18.16 20.26,18.16 19.56,17.46 19.56,16.47 19.58,16.45 v19.58,11.51
RXLED
  Top 0.152: R5.1 8.51,8.43 U1.17
SCK  (via drill 0.35)
  Top 0.152: v30.05,24.21 31.66,24.21 U3.26 | U2.18 20.77,16.99 v20.75,16.97
  Bottom 0.152: v30.05,24.21 30.02,24.21 22.81,16.99 20.78,16.99 v20.75,16.97
SCL  (via drill 0.35)
  Top 0.152: J1.2 6.03,33 5.3,33.73 2.17,33.73 1.45,33.01 R15.2 | U3.3 21.62,29.82 21.43,30 20.68,30 v20.42,29.74
  Bottom 0.152: J1.2 6.27,33.8 6.81,34.34 13.16,34.34 13.51,33.98 13.51,32.46 16.79,29.18 19.86,29.18 v20.42,29.74
SDA  (via drill 0.35)
  Top 0.152: J1.1 2.81,33 R14.2 | U3.2 21.96,31.04 20.93,31.04 20.62,30.73 v20.62,30.58
  Bottom 0.152: v20.62,30.58 20.34,30.58 19.53,29.77 17.09,29.77 14.12,32.74 14.12,34.44 13.41,35.15 6.07,35.15 5,34.08 J1.1
SWCLK
  Top 0.152: DEBUG1.4 36.56,30.66 37.23,31.32 37.23,32.38 36.75,32.86 33.77,32.86 33.63,32.72 33.63,31.67 33.17,31.22 U3.36
SWDIO  (via drill 0.35)
  Top 0.152: U3.37 32.98,31.92 v32.99,31.9
  Bottom 0.152: DEBUG1.2 36.16,31.93 35.41,32.68 33.49,32.68 32.99,32.18 v32.99,31.9
SWO  (via drill 0.35)
  Top 0.152: U3.32 32.82,28.42 v33.1,28.14
  Bottom 0.152: v33.1,28.14 33.1,26.3 33.63,25.76 36.37,25.76 37.02,26.42 37.02,28.8 36.44,29.39 DEBUG1.6
TXD.FT
  Top 0.152: U1.20 8.37,10.48 8.37,11.19 8.66,11.48 16,11.48 17.09,10.39 17.09,8.48 17.32,8.26 R12.1
TXD.NRF  (via drill 0.35)
  Top 0.152: R13.2 20.52,10.17 v20.52,11.48 | U3.19 27.78,23.07 v27.33,23.52
  Bottom 0.152: v27.33,23.52 26.94,23.13 26.95,23.13 21.67,17.85 20.39,17.85 19.87,17.33 19.87,16.6 20.52,15.94 v20.52,11.48
TXLED  (via drill 0.35)
  Top 0.152: v7.77,11.18 5.97,9.37 5.97,7.53 3.83,5.39 3.83,5.09 3.7,4.95 3.25,4.95 U1.10 | R6.1 10.26,10.06 v9.42,10.9
  Bottom 0.152: v9.42,10.9 8.05,10.9 v7.77,11.18
USB+  (via drill 0.35)
  Top 0.152: C2.1 13.38,2.97 R2.1 10.71,2.37 10.26,1.93 8.46,1.93 6.55,3.83 6.55,5.92 v6.15,6.33
  Bottom 0.152: v6.15,6.33 5.82,5.99 USB1.3
USB-  (via drill 0.35)
  Top 0.152: R1.1 12.32,6.19 13.99,6.19 14.49,5.69 14.49,4.82 C1.2 15.24,3.26 13.55,1.57 7.75,1.57 5.97,3.35 5.97,5.08 v5.69,5.36
  Bottom 0.152: USB1.2 4.29,5.36 v5.69,5.36
V_USB  (via drill 0.35)
  Top 0.152: U1.15 7.59,7.28 7.57,7.3 7.38,7.3 6.93,6.86 v6.93,6.78
  Bottom 0.152: v6.93,6.78 6.93,5.19 D2.+
  Bottom 0.406: USB1.1 4.67,4.69
  Bottom 0.457: D2.+ 5.33,4.62 5.31,4.64 4.73,4.63 4.67,4.69 | D2.+
VIN  (via drill 0.35)
  Top 0.152: C4.2 5.91,31.16 R3.2 | LDO1.3 9.35,26.66 8.67,25.98 7.74,25.98 7.25,26.47 7.25,28.41 7.11,28.55
  Top 0.66: 6.07,28.55 v6.07,28.42 | LDO1.1 8.23,28.56 C5.2 8.17,28.55 7.11,28.55 6.07,28.55 | CHRG1.4 4.4,29.75 C4.2 4.92,29.7 6.07,28.55
  Bottom 0.61: D1.- 10.41,2.33 11.07,2.99
  Bottom 0.66: v6.07,28.42 6.07,27.03 5,25.96 5,17.8 11.07,11.73 11.07,2.99
  Bottom 0.711: D1.- D2.-
VLIPO  (via drill 0.35)
  Top 0.152: R10.2 3.91,17.12 J2.2
  Top 0.66: CHRG1.3 2.98,25.52 C13.1 2.9,25.36 v2.9,23.9
  Bottom 0.61: 2.26,14.63 J2.2
  Bottom 0.66: v2.9,23.9 2.9,15.27 2.26,14.63 | D1.+ 7.82,4.66 7.82,8.13 7.66,8.13 5.84,9.94 5.84,11.02 2.23,14.63 J2.2

### Text on the board
tNames: +
bNames: +